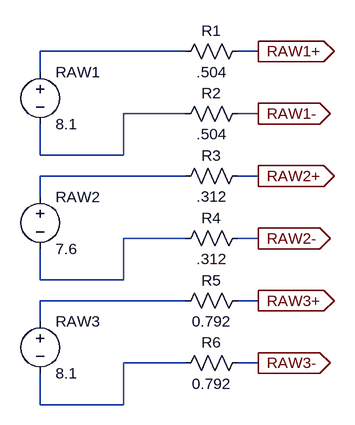
[diagram p0: schematic TOP-power-supply.full-voltages.asc]
TOP-power-supply.full-voltages.asc, the LTspice schematic file:
Version 4
SHEET 1 1640 680
WIRE 176 -80 -48 -80
WIRE 288 -80 256 -80
WIRE -48 -48 -48 -80
WIRE 176 16 80 16
WIRE 288 16 256 16
WIRE -48 80 -48 32
WIRE 80 80 80 16
WIRE 80 80 -48 80
WIRE 176 112 -48 112
WIRE 288 112 256 112
WIRE -48 144 -48 112
WIRE 176 208 80 208
WIRE 288 208 256 208
WIRE -48 272 -48 224
WIRE 80 272 80 208
WIRE 80 272 -48 272
WIRE 176 304 -48 304
WIRE 288 304 256 304
WIRE -48 336 -48 304
WIRE 176 400 80 400
WIRE 288 400 256 400
WIRE -48 464 -48 416
WIRE 80 464 80 400
WIRE 80 464 -48 464
FLAG 288 -80 RAW1+
IOPIN 288 -80 Out
FLAG 288 16 RAW1-
IOPIN 288 16 Out
FLAG 288 208 RAW2-
IOPIN 288 208 Out
FLAG 288 400 RAW3-
IOPIN 288 400 Out
FLAG 288 112 RAW2+
IOPIN 288 112 Out
FLAG 288 304 RAW3+
IOPIN 288 304 Out
SYMBOL voltage -48 -64 R0
WINDOW 123 0 0 Left 2
WINDOW 39 24 124 Left 2
SYMATTR InstName RAW1
SYMATTR Value 8.1
SYMBOL voltage -48 128 R0
WINDOW 123 0 0 Left 2
WINDOW 39 24 124 Left 2
SYMATTR InstName RAW2
SYMATTR Value 7.6
SYMBOL voltage -48 320 R0
WINDOW 123 0 0 Left 2
WINDOW 39 24 124 Left 2
SYMATTR InstName RAW3
SYMATTR Value 8.1
SYMBOL res 272 -96 R90
WINDOW 0 0 56 VBottom 2
WINDOW 3 32 56 VTop 2
SYMATTR InstName R1
SYMATTR Value .504
SYMBOL res 272 0 R90
WINDOW 0 0 56 VBottom 2
WINDOW 3 32 56 VTop 2
SYMATTR InstName R2
SYMATTR Value .504
SYMBOL res 272 96 R90
WINDOW 0 0 56 VBottom 2
WINDOW 3 32 56 VTop 2
SYMATTR InstName R3
SYMATTR Value .312
SYMBOL res 272 192 R90
WINDOW 0 0 56 VBottom 2
WINDOW 3 32 56 VTop 2
SYMATTR InstName R4
SYMATTR Value .312
SYMBOL res 272 288 R90
WINDOW 0 0 56 VBottom 2
WINDOW 3 32 56 VTop 2
SYMATTR InstName R5
SYMATTR Value 0.792
SYMBOL res 272 384 R90
WINDOW 0 0 56 VBottom 2
WINDOW 3 32 56 VTop 2
SYMATTR InstName R6
SYMATTR Value 0.792

The netlist it stands for:
* TOP-power-supply.full-voltages.asc
V§RAW1 N001 N002 8.1
V§RAW2 N003 N004 7.6
V§RAW3 N005 N006 8.1
R1 RAW1+ N001 .504
R2 RAW1- N002 .504
R3 RAW2+ N003 .312
R4 RAW2- N004 .312
R5 RAW3+ N005 0.792
R6 RAW3- N006 0.792
.backanno
.end